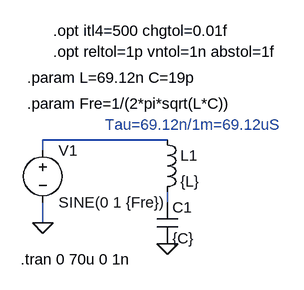
[diagram p0: schematic Draft1.asc]
Draft1.asc, the LTspice schematic file:
Version 4
SHEET 1 880 680
WIRE 304 48 112 48
WIRE 112 64 112 48
WIRE 304 144 304 128
WIRE 112 176 112 144
FLAG 304 208 0
FLAG 112 176 0
SYMBOL ind 288 32 R0
SYMATTR InstName L1
SYMATTR Value {L}
SYMATTR SpiceLine Rpar=1e37
SYMBOL cap 288 144 R0
SYMATTR InstName C1
SYMATTR Value {C}
SYMATTR SpiceLine Rpar=1e37
SYMBOL voltage 112 48 R0
WINDOW 123 0 0 Left 2
WINDOW 39 0 0 Left 2
SYMATTR InstName V1
SYMATTR Value SINE(0 1 {Fre})
TEXT 88 -8 Left 2 !.param Fre=1/(2*pi*sqrt(L*C))
TEXT 88 -48 Left 2 !.param L=69.12n C=19p
TEXT 78 232 Left 2 !.tran 0 70u 0 1n
TEXT 128 -88 Left 2 !.opt reltol=1p vntol=1n abstol=1f
TEXT 208 24 Left 2 ;Tau=69.12n/1m=69.12uS
TEXT 128 -120 Left 2 !.opt itl4=500 chgtol=0.01f

The netlist it stands for:
* Draft1.asc
L1 N001 N002 {L} Rpar=1e37
C1 N002 0 {C} Rpar=1e37
V1 N001 0 SINE(0 1 {Fre})
.param Fre=1/(2*pi*sqrt(L*C))
.param L=69.12n C=19p
.tran 0 70u 0 1n
.opt reltol=1p vntol=1n abstol=1f
* Tau=69.12n/1m=69.12uS
.opt itl4=500 chgtol=0.01f
.backanno
.end